# Altium schematic sheet Peripheral Connections.SchDoc
size A; SheetNumber: 9; SheetTotal: 9
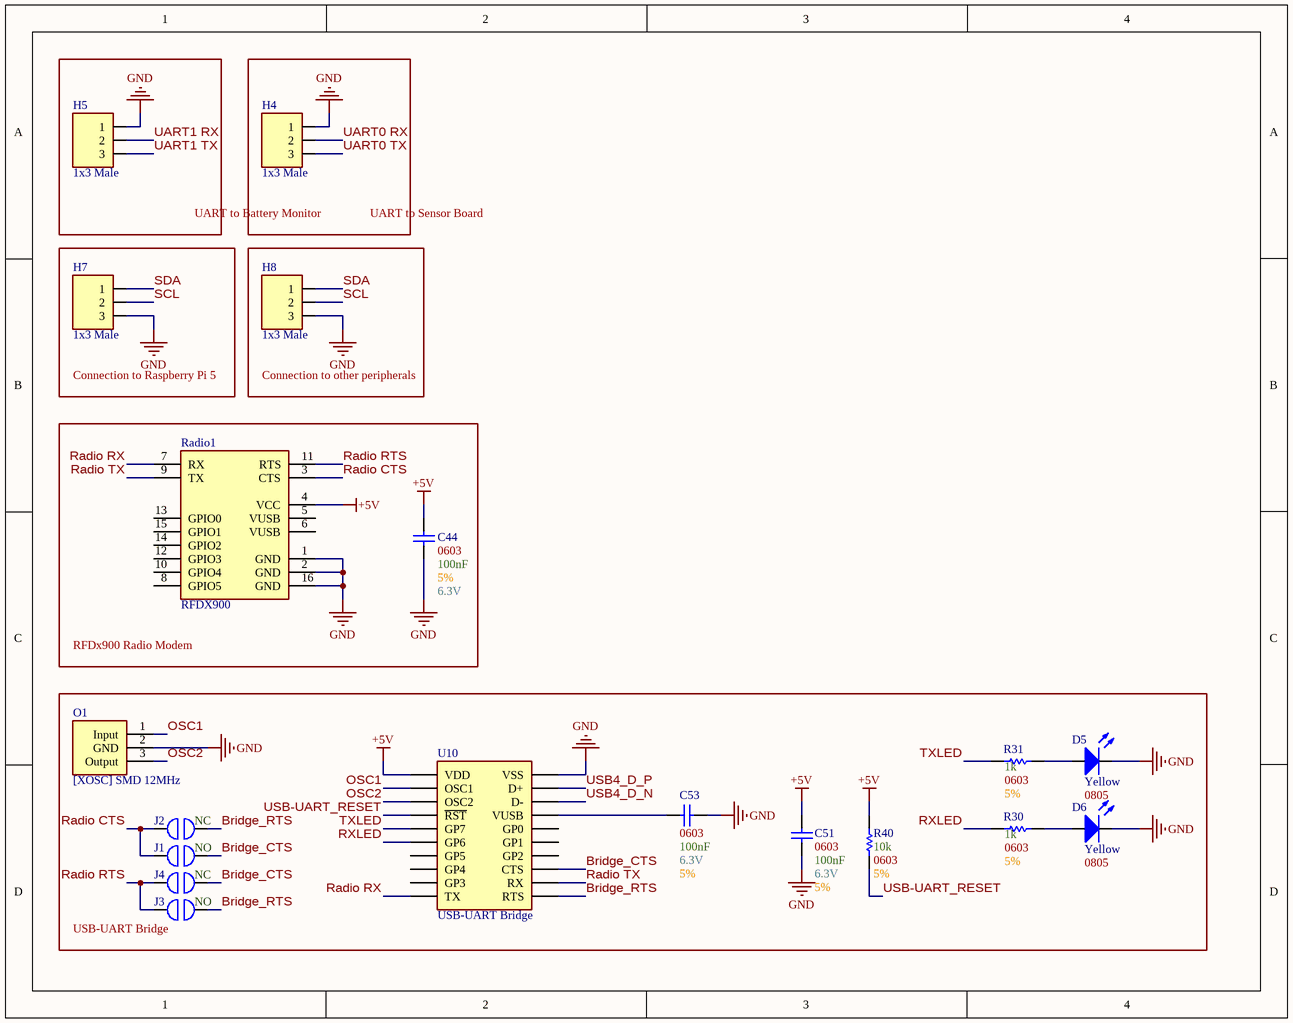
[diagram p0: Peripheral Connections.SchDoc]

## Parts
C44  Size Package: 0603  Capacitance: 100nF  Voltage: 6.3V  Tolerance: 5%  [[Cap] SMD 0603]  (hidden comment: [Cap] SMD Nonpolarized)
C51  Size Package: 0603  Capacitance: 100nF  Voltage: 6.3V  Tolerance: 5%  [[Cap] SMD 0603]  (hidden comment: [Cap] SMD Nonpolarized)
C53  Size Package: 0603  Capacitance: 100nF  Voltage: 6.3V  Tolerance: 5%  [[Cap] SMD 0603]  (hidden comment: [Cap] SMD Nonpolarized)
D5  Color: Yellow  Size Package: 0805  [[LED] SMD 0805]  (hidden comment: SMD LED)
D6  Color: Yellow  Size Package: 0805  [[LED] SMD 0805]  (hidden comment: SMD LED)
H4  1x3 Male  [[Header] Shrouded 1x3 Male]
H5  1x3 Male  [[Header] Shrouded 1x3 Male]
H7  1x3 Male  [[Header] Shrouded 1x3 Male]
H8  1x3 Male  [[Header] Shrouded 1x3 Male]
J1  NO/NC: NO  [[Jumper] Solderable Jumper]  (hidden comment: [Jump] SMD Jumper)  (no BOM)
J2  NO/NC: NC  [[Jumper] Solderable Jumper]  (hidden comment: [Jump] SMD Jumper)  (no BOM)
J3  NO/NC: NO  [[Jumper] Solderable Jumper]  (hidden comment: [Jump] SMD Jumper)  (no BOM)
J4  NO/NC: NC  [[Jumper] Solderable Jumper]  (hidden comment: [Jump] SMD Jumper)  (no BOM)
O1  [XOSC] SMD 12MHz  [[XOSC] SMD 12MHz]
R30  Resistance: 1k  Size Package: 0603  Tolerance: 5%  [[Res] SMD 0603]  (hidden comment: [Res] SMD Resistor)
R31  Resistance: 1k  Size Package: 0603  Tolerance: 5%  [[Res] SMD 0603]  (hidden comment: [Res] SMD Resistor)
R40  Resistance: 10k  Size Package: 0603  Tolerance: 5%  [[Res] SMD 0603]  (hidden comment: [Res] SMD Resistor)
Radio1  RFDX900  [[Device] RFDX900 Radio SMD Mount]
U10  USB-UART Bridge  [[IC] USB-UART Bridge]

## Blocks framed on the sheet
UART to Battery Monitor: H5
UART to Sensor Board: H4
Connection to Raspberry Pi 5: H7
Connection to other peripherals: H8
RFDx900 Radio Modem: C44 Radio1
USB-UART Bridge: C51 C53 D5 D6 J1-J4 O1 R30 R31 R40 U10

## Nets
+5V: C44.2 C51.2 R40.2 Radio1.4(VCC) U10.1(VDD)
GND: C44.1 C51.1 C53.1 D5.2(Cathode) D6.2(Cathode) H4.1 H5.1 H7.3 H8.3 O1.2(GND) Radio1.1(GND) Radio1.2(GND) Radio1.16(GND) U10.20(VSS)
Bridge_CTS: J1.2 J4.2 U10.13(CTS)
Bridge_RTS: J2.2 J3.2 U10.11(RTS)
OSC1: O1.1(Input) U10.2(OSC1)
OSC2: O1.3(Output) U10.3(OSC2)
Radio CTS: J1.1 J2.1 Radio1.3(CTS)
Radio RTS: J3.1 J4.1 Radio1.11(RTS)
Radio RX: Radio1.7(RX) U10.10(TX)
Radio TX: Radio1.9(TX) U10.12(RX)
RXLED: R30.2 U10.6(GP6)
SCL: H7.2 H8.2
SDA: H7.1 H8.1
TXLED: R31.2 U10.5(GP7)
UART0 RX: H4.2
UART0 TX: H4.3
UART1 RX: H5.2
UART1 TX: H5.3
USB4_D_N: U10.18(D-)
USB4_D_P: U10.19(D+)
USB-UART_RESET: R40.1 U10.4(~{RST})
NetC53_2: C53.2 U10.17(VUSB)
NetD5_1: D5.1(Anode) R31.1
NetD6_1: D6.1(Anode) R30.1

Not connected (* = marked no-connect by the designer): Radio1 5(VUSB) 6(VUSB) 8(GPIO5) 10(GPIO4) 12(GPIO3) 13(GPIO0) 14(GPIO2) 15(GPIO1); U10 7(GP5) 8(GP4) 9(GP3) 14(GP2) 15(GP1) 16(GP0)

## Library data of the parts
D5 D6 = [LED] SMD: Generic; Part #: *; Supplier 1: DigiKey; Supplier Part Number 1: 3147-B1701UY--20D000214U1930CT-ND
H4 H5 H7 H8 = [Header] Shrouded 1x3 Male: 070543-0037 / Mates with 005057-9403; Supplier 1: DigiKey; Supplier Part Number 1: WM4825-ND
  H7 H8: Supplier 2: DigiKey; Supplier Part Number 2: WM2901-ND
J1-J4 = [Jump] SMD Jumper: Solderable jumper
R30 R31 R40 = [Res] SMD Resistor: Generic; Supplier 1: DigiKey
  R30 R31: Supplier Part Number 1: RMCF0603FT1K00DKR-ND
  R40: Supplier Part Number 1: 311-10.0KHRDKR-ND
Radio1 = [Device] RFDX900 Radio: RFDX900 Long-Range RF Module; Supplier 1: DigiKey; Supplier Part Number 1: 609-71609-308LF-ND
U10 = [IC] USB-UART Bridge: MCP2200T-I/SO; Supplier 1: DigiKey; Supplier Part Number 1: MCP2200T-I/SOCT-ND
C44 C51 C53 = [Cap] SMD Nonpolarized: Supplier 1: DigiKey; Supplier Part Number 1: 311-1088-6-ND
O1 = [XOSC] SMD 12MHz: Supplier 1: DigiKey; Supplier Part Number 1: 490-17947-1-ND